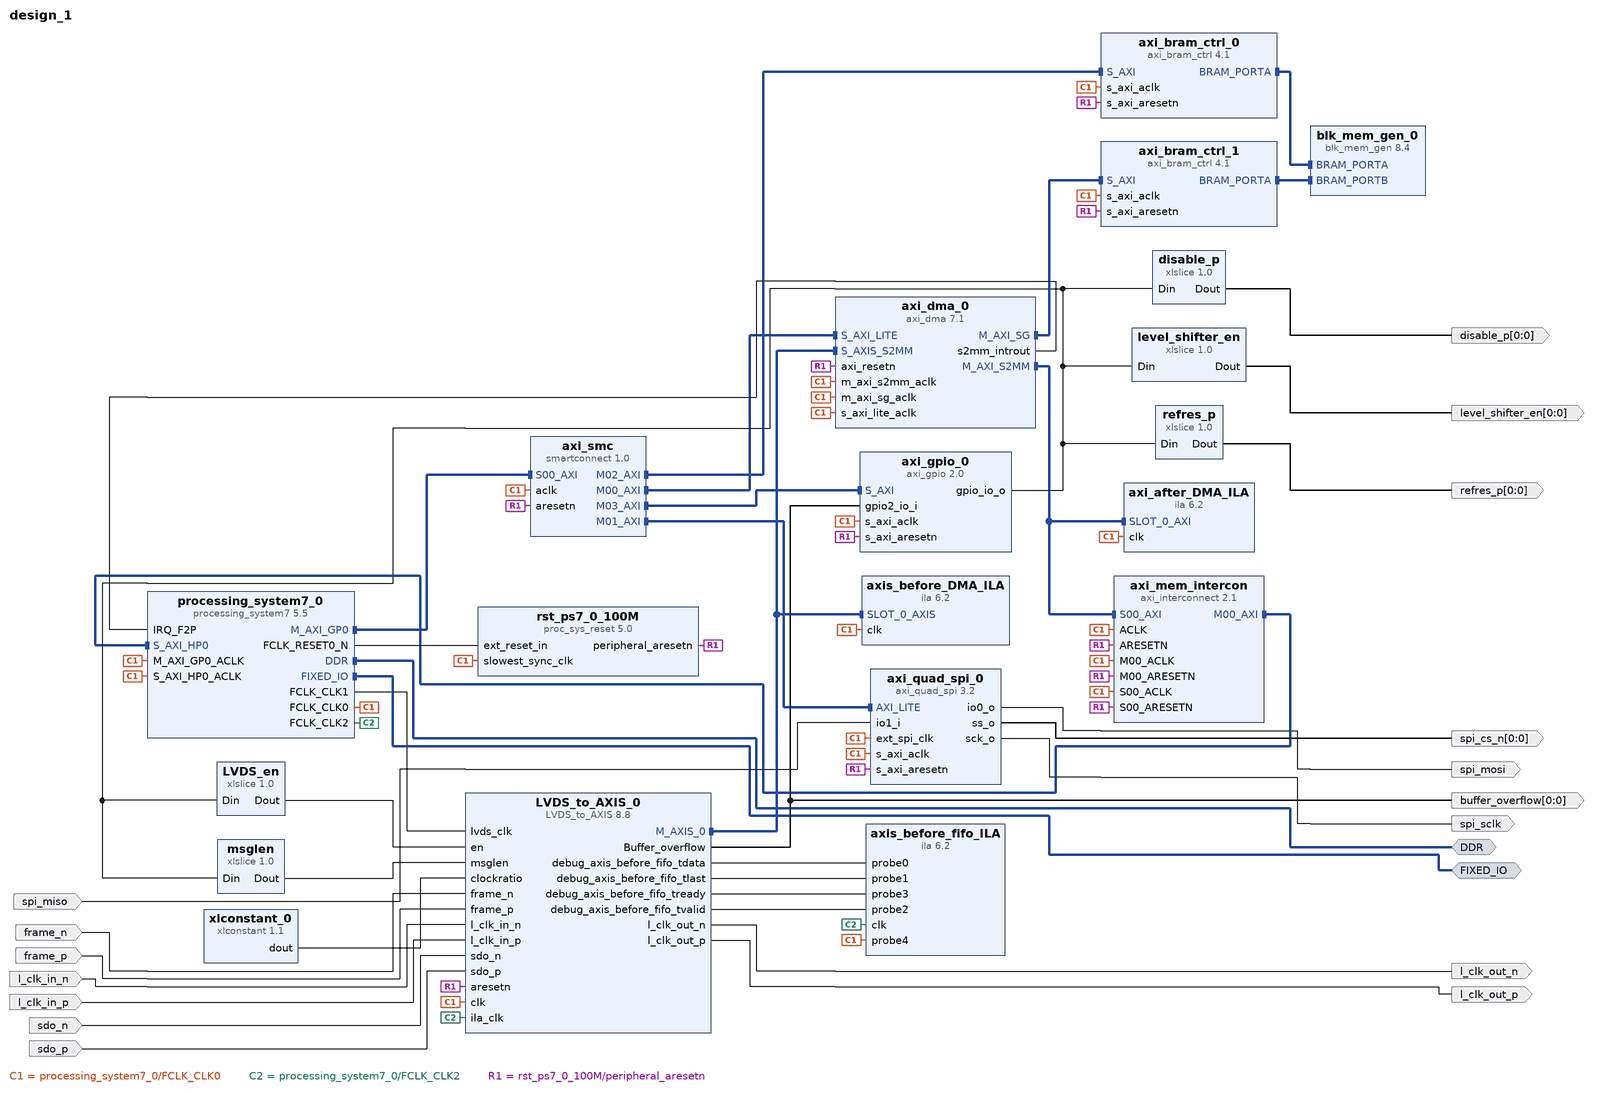
[diagram p0: block diagram of the top level]
# Vivado block design design_1, xc7z020clg484-1, Vivado 2024.2
create_bd_design design_1

create_bd_intf_port -mode Master -vlnv xilinx.com:interface:ddrx_rtl:1.0 DDR
create_bd_intf_port -mode Master -vlnv xilinx.com:display_processing_system7:fixedio_rtl:1.0 FIXED_IO
create_bd_port -dir O l_clk_out_n
create_bd_port -dir O l_clk_out_p
create_bd_port -dir I frame_p
create_bd_port -dir I frame_n
create_bd_port -dir I l_clk_in_n
create_bd_port -dir I l_clk_in_p
create_bd_port -dir I sdo_n
create_bd_port -dir I sdo_p
create_bd_port -dir O -from 0 -to 0 level_shifter_en
create_bd_port -dir O -from 0 -to 0 refres_p
create_bd_port -dir O -from 0 -to 0 disable_p
create_bd_port -dir O -from 0 -to 0 spi_cs_n
create_bd_port -dir O spi_sclk
create_bd_port -dir I spi_miso
create_bd_port -dir O spi_mosi
create_bd_port -dir O -from 0 -to 0 buffer_overflow

create_bd_cell -type ip -vlnv xilinx.com:user:LVDS_to_AXIS:8.8 LVDS_to_AXIS_0
create_bd_cell -type ip -vlnv xilinx.com:ip:axi_dma:7.1 axi_dma_0
set_property -dict [list \
  CONFIG.c_include_mm2s 0 \
  CONFIG.c_m_axi_s2mm_data_width 64 \
  CONFIG.c_s2mm_burst_size 256 \
  CONFIG.c_s_axis_s2mm_tdata_width 64 \
  CONFIG.c_sg_include_stscntrl_strm 0 \
] [get_bd_cells axi_dma_0]
create_bd_cell -type ip -vlnv xilinx.com:ip:xlconstant:1.1 xlconstant_0
set_property -dict {CONFIG.CONST_VAL 2 CONFIG.CONST_WIDTH 3} [get_bd_cells xlconstant_0]
create_bd_cell -type ip -vlnv xilinx.com:ip:axi_quad_spi:3.2 axi_quad_spi_0
set_property -dict {CONFIG.C_FIFO_DEPTH 256 CONFIG.C_USE_STARTUP 0} [get_bd_cells axi_quad_spi_0]
create_bd_cell -type ip -vlnv xilinx.com:ip:processing_system7:5.5 processing_system7_0
set_property -dict [list \
  CONFIG.PCW_APU_PERIPHERAL_FREQMHZ 667.0 \
  CONFIG.PCW_ENET0_ENET0_IO {MIO 16 .. 27} \
  CONFIG.PCW_ENET0_GRP_MDIO_ENABLE 1 \
  CONFIG.PCW_ENET0_GRP_MDIO_IO EMIO \
  CONFIG.PCW_ENET0_PERIPHERAL_CLKSRC External \
  CONFIG.PCW_ENET0_PERIPHERAL_ENABLE 1 \
  CONFIG.PCW_ENET0_RESET_ENABLE 0 \
  CONFIG.PCW_ENET_RESET_ENABLE 1 \
  CONFIG.PCW_ENET_RESET_SELECT {Share reset pin} \
  CONFIG.PCW_EN_CLK1_PORT 1 \
  CONFIG.PCW_EN_CLK2_PORT 1 \
  CONFIG.PCW_FCLK_CLK1_BUF TRUE \
  CONFIG.PCW_FCLK_CLK2_BUF TRUE \
  CONFIG.PCW_FPGA0_PERIPHERAL_FREQMHZ 50 \
  CONFIG.PCW_FPGA1_PERIPHERAL_FREQMHZ 100 \
  CONFIG.PCW_FPGA2_PERIPHERAL_FREQMHZ 200 \
  CONFIG.PCW_FPGA_FCLK1_ENABLE 1 \
  CONFIG.PCW_FPGA_FCLK2_ENABLE 1 \
  CONFIG.PCW_GPIO_MIO_GPIO_ENABLE 1 \
  CONFIG.PCW_GPIO_MIO_GPIO_IO MIO \
  CONFIG.PCW_I2C_RESET_ENABLE 1 \
  CONFIG.PCW_IRQ_F2P_INTR 1 \
  CONFIG.PCW_PRESET_BANK1_VOLTAGE {LVCMOS 1.8V} \
  CONFIG.PCW_QSPI_GRP_FBCLK_ENABLE 1 \
  CONFIG.PCW_QSPI_GRP_FBCLK_IO {MIO 8} \
  CONFIG.PCW_QSPI_GRP_SINGLE_SS_ENABLE 1 \
  CONFIG.PCW_QSPI_GRP_SINGLE_SS_IO {MIO 1 .. 6} \
  CONFIG.PCW_QSPI_PERIPHERAL_ENABLE 1 \
  CONFIG.PCW_QSPI_QSPI_IO {MIO 1 .. 6} \
  CONFIG.PCW_SD0_GRP_CD_ENABLE 1 \
  CONFIG.PCW_SD0_GRP_CD_IO {MIO 47} \
  CONFIG.PCW_SD0_GRP_WP_ENABLE 1 \
  CONFIG.PCW_SD0_GRP_WP_IO EMIO \
  CONFIG.PCW_SD0_PERIPHERAL_ENABLE 1 \
  CONFIG.PCW_SD0_SD0_IO {MIO 40 .. 45} \
  CONFIG.PCW_SDIO_PERIPHERAL_FREQMHZ 50 \
  CONFIG.PCW_SINGLE_QSPI_DATA_MODE x4 \
  CONFIG.PCW_TTC0_PERIPHERAL_ENABLE 1 \
  CONFIG.PCW_TTC0_TTC0_IO EMIO \
  CONFIG.PCW_UART1_PERIPHERAL_ENABLE 1 \
  CONFIG.PCW_UART1_UART1_IO {MIO 48 .. 49} \
  CONFIG.PCW_UART_PERIPHERAL_FREQMHZ 100 \
  CONFIG.PCW_UIPARAM_DDR_FREQ_MHZ 533.333 \
  CONFIG.PCW_UIPARAM_DDR_PARTNO {MT41K128M16 JT-125} \
  CONFIG.PCW_USB0_PERIPHERAL_ENABLE 1 \
  CONFIG.PCW_USB0_RESET_ENABLE 1 \
  CONFIG.PCW_USB0_RESET_IO {MIO 46} \
  CONFIG.PCW_USB0_USB0_IO {MIO 28 .. 39} \
  CONFIG.PCW_USB_RESET_ENABLE 1 \
  CONFIG.PCW_USB_RESET_SELECT {Share reset pin} \
  CONFIG.PCW_USE_FABRIC_INTERRUPT 1 \
  CONFIG.PCW_USE_S_AXI_HP0 1 \
] [get_bd_cells processing_system7_0]
# 219 more settings of processing_system7_0 are not shown: defaults, MIO pin electricals, DDR timing, and values the tool derives
create_bd_cell -type ip -vlnv xilinx.com:ip:smartconnect:1.0 axi_smc
set_property -dict {CONFIG.NUM_MI 4 CONFIG.NUM_SI 1} [get_bd_cells axi_smc]
create_bd_cell -type ip -vlnv xilinx.com:ip:proc_sys_reset:5.0 rst_ps7_0_100M
create_bd_cell -type ip -vlnv xilinx.com:ip:axi_interconnect:2.1 axi_mem_intercon
set_property -dict {CONFIG.NUM_MI 1} [get_bd_cells axi_mem_intercon]
create_bd_cell -type ip -vlnv xilinx.com:ip:axi_gpio:2.0 axi_gpio_0
set_property -dict [list \
  CONFIG.C_ALL_INPUTS 0 \
  CONFIG.C_ALL_INPUTS_2 1 \
  CONFIG.C_ALL_OUTPUTS 1 \
  CONFIG.C_GPIO2_WIDTH 1 \
  CONFIG.C_GPIO_WIDTH 11 \
  CONFIG.C_IS_DUAL 1 \
  CONFIG.GPIO_BOARD_INTERFACE Custom \
  CONFIG.USE_BOARD_FLOW true \
] [get_bd_cells axi_gpio_0]
create_bd_cell -type ip -vlnv xilinx.com:ip:axi_bram_ctrl:4.1 axi_bram_ctrl_0
set_property -dict {CONFIG.SINGLE_PORT_BRAM 1} [get_bd_cells axi_bram_ctrl_0]
create_bd_cell -type ip -vlnv xilinx.com:ip:axi_bram_ctrl:4.1 axi_bram_ctrl_1
set_property -dict {CONFIG.SINGLE_PORT_BRAM 1} [get_bd_cells axi_bram_ctrl_1]
create_bd_cell -type ip -vlnv xilinx.com:ip:blk_mem_gen:8.4 blk_mem_gen_0
set_property -dict {CONFIG.EN_SAFETY_CKT false CONFIG.Memory_Type True_Dual_Port_RAM} [get_bd_cells blk_mem_gen_0]
create_bd_cell -type ip -vlnv xilinx.com:ip:xlslice:1.0 LVDS_en
set_property -dict {CONFIG.DIN_WIDTH 11} [get_bd_cells LVDS_en]
create_bd_cell -type ip -vlnv xilinx.com:ip:xlslice:1.0 disable_p
set_property -dict {CONFIG.DIN_FROM 1 CONFIG.DIN_TO 1 CONFIG.DIN_WIDTH 11} [get_bd_cells disable_p]
create_bd_cell -type ip -vlnv xilinx.com:ip:xlslice:1.0 refres_p
set_property -dict {CONFIG.DIN_FROM 2 CONFIG.DIN_TO 2 CONFIG.DIN_WIDTH 11} [get_bd_cells refres_p]
create_bd_cell -type ip -vlnv xilinx.com:ip:xlslice:1.0 level_shifter_en
set_property -dict {CONFIG.DIN_FROM 3 CONFIG.DIN_TO 3 CONFIG.DIN_WIDTH 11} [get_bd_cells level_shifter_en]
create_bd_cell -type ip -vlnv xilinx.com:ip:xlslice:1.0 msglen
set_property -dict {CONFIG.DIN_FROM 9 CONFIG.DIN_TO 4 CONFIG.DIN_WIDTH 11} [get_bd_cells msglen]
create_bd_cell -type ip -vlnv xilinx.com:ip:ila:6.2 axis_before_fifo_ILA
set_property -dict [list \
  CONFIG.C_MONITOR_TYPE Native \
  CONFIG.C_NUM_OF_PROBES 5 \
  CONFIG.C_PROBE0_WIDTH 64 \
  CONFIG.C_PROBE3_WIDTH 1 \
  CONFIG.C_SLOT_0_AXIS_TDATA_WIDTH 64 \
  CONFIG.C_SLOT_0_AXIS_TDEST_WIDTH 0 \
  CONFIG.C_SLOT_0_AXIS_TID_WIDTH 0 \
  CONFIG.C_SLOT_0_AXIS_TUSER_WIDTH 0 \
  CONFIG.C_SLOT_0_AXI_PROTOCOL AXI4S \
] [get_bd_cells axis_before_fifo_ILA]
create_bd_cell -type ip -vlnv xilinx.com:ip:ila:6.2 axis_before_DMA_ILA
set_property -dict {CONFIG.C_DATA_DEPTH 16384 CONFIG.C_SLOT_0_AXI_PROTOCOL AXI4S} [get_bd_cells axis_before_DMA_ILA]
create_bd_cell -type ip -vlnv xilinx.com:ip:ila:6.2 axi_after_DMA_ILA

# ---- connections ----

connect_bd_intf_net [get_bd_intf_pins LVDS_to_AXIS_0/M_AXIS_0] [get_bd_intf_pins axi_dma_0/S_AXIS_S2MM]
connect_bd_intf_net [get_bd_intf_pins LVDS_to_AXIS_0/M_AXIS_0] [get_bd_intf_pins axis_before_DMA_ILA/SLOT_0_AXIS]
connect_bd_intf_net [get_bd_intf_pins axi_bram_ctrl_0/BRAM_PORTA] [get_bd_intf_pins blk_mem_gen_0/BRAM_PORTA]
connect_bd_intf_net [get_bd_intf_pins axi_bram_ctrl_1/BRAM_PORTA] [get_bd_intf_pins blk_mem_gen_0/BRAM_PORTB]
connect_bd_intf_net [get_bd_intf_pins axi_dma_0/M_AXI_S2MM] [get_bd_intf_pins axi_mem_intercon/S00_AXI]
connect_bd_intf_net [get_bd_intf_pins axi_dma_0/M_AXI_S2MM] [get_bd_intf_pins axi_after_DMA_ILA/SLOT_0_AXI]
connect_bd_intf_net [get_bd_intf_pins axi_bram_ctrl_1/S_AXI] [get_bd_intf_pins axi_dma_0/M_AXI_SG]
connect_bd_intf_net [get_bd_intf_pins axi_mem_intercon/M00_AXI] [get_bd_intf_pins processing_system7_0/S_AXI_HP0]
connect_bd_intf_net [get_bd_intf_pins axi_smc/M00_AXI] [get_bd_intf_pins axi_dma_0/S_AXI_LITE]
connect_bd_intf_net [get_bd_intf_pins axi_smc/M01_AXI] [get_bd_intf_pins axi_quad_spi_0/AXI_LITE]
connect_bd_intf_net [get_bd_intf_pins axi_smc/M02_AXI] [get_bd_intf_pins axi_bram_ctrl_0/S_AXI]
connect_bd_intf_net [get_bd_intf_pins axi_smc/M03_AXI] [get_bd_intf_pins axi_gpio_0/S_AXI]
connect_bd_intf_net [get_bd_intf_ports DDR] [get_bd_intf_pins processing_system7_0/DDR]
connect_bd_intf_net [get_bd_intf_ports FIXED_IO] [get_bd_intf_pins processing_system7_0/FIXED_IO]
connect_bd_intf_net [get_bd_intf_pins processing_system7_0/M_AXI_GP0] [get_bd_intf_pins axi_smc/S00_AXI]
connect_bd_net [get_bd_pins LVDS_en/Dout] [get_bd_pins LVDS_to_AXIS_0/en]
connect_bd_net [get_bd_pins LVDS_to_AXIS_0/Buffer_overflow] [get_bd_pins axi_gpio_0/gpio2_io_i] [get_bd_ports buffer_overflow]
connect_bd_net [get_bd_pins LVDS_to_AXIS_0/debug_axis_before_fifo_tdata] [get_bd_pins axis_before_fifo_ILA/probe0]
connect_bd_net [get_bd_pins LVDS_to_AXIS_0/debug_axis_before_fifo_tlast] [get_bd_pins axis_before_fifo_ILA/probe1]
connect_bd_net [get_bd_pins LVDS_to_AXIS_0/debug_axis_before_fifo_tready] [get_bd_pins axis_before_fifo_ILA/probe3]
connect_bd_net [get_bd_pins LVDS_to_AXIS_0/debug_axis_before_fifo_tvalid] [get_bd_pins axis_before_fifo_ILA/probe2]
connect_bd_net [get_bd_pins LVDS_to_AXIS_0/l_clk_out_n] [get_bd_ports l_clk_out_n]
connect_bd_net [get_bd_pins LVDS_to_AXIS_0/l_clk_out_p] [get_bd_ports l_clk_out_p]
connect_bd_net [get_bd_pins axi_gpio_0/gpio_io_o] \
  [get_bd_pins LVDS_en/Din] [get_bd_pins disable_p/Din] [get_bd_pins refres_p/Din] [get_bd_pins level_shifter_en/Din] \
  [get_bd_pins msglen/Din]
connect_bd_net [get_bd_pins axi_dma_0/s2mm_introut] [get_bd_pins processing_system7_0/IRQ_F2P]
connect_bd_net [get_bd_pins axi_quad_spi_0/io0_o] [get_bd_ports spi_mosi]
connect_bd_net [get_bd_pins axi_quad_spi_0/sck_o] [get_bd_ports spi_sclk]
connect_bd_net [get_bd_pins axi_quad_spi_0/ss_o] [get_bd_ports spi_cs_n]
connect_bd_net [get_bd_pins disable_p/Dout] [get_bd_ports disable_p]
connect_bd_net -net frame_n_0_1 [get_bd_ports frame_n] [get_bd_pins LVDS_to_AXIS_0/frame_n]
connect_bd_net -net frame_p_0_1 [get_bd_ports frame_p] [get_bd_pins LVDS_to_AXIS_0/frame_p]
connect_bd_net -net io1_i_0_1 [get_bd_ports spi_miso] [get_bd_pins axi_quad_spi_0/io1_i]
connect_bd_net -net l_clk_in_n_0_1 [get_bd_ports l_clk_in_n] [get_bd_pins LVDS_to_AXIS_0/l_clk_in_n]
connect_bd_net -net l_clk_in_p_0_1 [get_bd_ports l_clk_in_p] [get_bd_pins LVDS_to_AXIS_0/l_clk_in_p]
connect_bd_net [get_bd_pins level_shifter_en/Dout] [get_bd_ports level_shifter_en]
connect_bd_net [get_bd_pins msglen/Dout] [get_bd_pins LVDS_to_AXIS_0/msglen]
connect_bd_net [get_bd_pins processing_system7_0/FCLK_CLK0] \
  [get_bd_pins processing_system7_0/M_AXI_GP0_ACLK] [get_bd_pins axi_smc/aclk] [get_bd_pins axi_dma_0/s_axi_lite_aclk] \
  [get_bd_pins rst_ps7_0_100M/slowest_sync_clk] [get_bd_pins axi_quad_spi_0/s_axi_aclk] \
  [get_bd_pins axi_dma_0/m_axi_s2mm_aclk] [get_bd_pins axi_mem_intercon/S00_ACLK] \
  [get_bd_pins processing_system7_0/S_AXI_HP0_ACLK] [get_bd_pins axi_mem_intercon/M00_ACLK] \
  [get_bd_pins axi_mem_intercon/ACLK] [get_bd_pins axi_bram_ctrl_0/s_axi_aclk] [get_bd_pins axi_bram_ctrl_1/s_axi_aclk] \
  [get_bd_pins axi_dma_0/m_axi_sg_aclk] [get_bd_pins axi_gpio_0/s_axi_aclk] [get_bd_pins axi_quad_spi_0/ext_spi_clk] \
  [get_bd_pins axis_before_DMA_ILA/clk] [get_bd_pins axi_after_DMA_ILA/clk] [get_bd_pins LVDS_to_AXIS_0/clk] \
  [get_bd_pins axis_before_fifo_ILA/probe4]
connect_bd_net [get_bd_pins processing_system7_0/FCLK_CLK1] [get_bd_pins LVDS_to_AXIS_0/lvds_clk]
connect_bd_net [get_bd_pins processing_system7_0/FCLK_CLK2] [get_bd_pins axis_before_fifo_ILA/clk] [get_bd_pins LVDS_to_AXIS_0/ila_clk]
connect_bd_net [get_bd_pins processing_system7_0/FCLK_RESET0_N] [get_bd_pins rst_ps7_0_100M/ext_reset_in]
connect_bd_net [get_bd_pins refres_p/Dout] [get_bd_ports refres_p]
connect_bd_net [get_bd_pins rst_ps7_0_100M/peripheral_aresetn] \
  [get_bd_pins axi_dma_0/axi_resetn] [get_bd_pins axi_smc/aresetn] [get_bd_pins axi_quad_spi_0/s_axi_aresetn] \
  [get_bd_pins axi_mem_intercon/S00_ARESETN] [get_bd_pins axi_mem_intercon/M00_ARESETN] \
  [get_bd_pins axi_mem_intercon/ARESETN] [get_bd_pins axi_bram_ctrl_0/s_axi_aresetn] \
  [get_bd_pins axi_bram_ctrl_1/s_axi_aresetn] [get_bd_pins axi_gpio_0/s_axi_aresetn] [get_bd_pins LVDS_to_AXIS_0/aresetn]
connect_bd_net -net sdo_n_0_1 [get_bd_ports sdo_n] [get_bd_pins LVDS_to_AXIS_0/sdo_n]
connect_bd_net -net sdo_p_0_1 [get_bd_ports sdo_p] [get_bd_pins LVDS_to_AXIS_0/sdo_p]
connect_bd_net [get_bd_pins xlconstant_0/dout] [get_bd_pins LVDS_to_AXIS_0/clockratio]
set_property HDL_ATTRIBUTE.BMM_INFO_PROCESSOR {arm > design_1 axi_bram_ctrl_0} [get_bd_cells processing_system7_0]
set_property HDL_ATTRIBUTE.KEEP_HIERARCHY yes [get_bd_cells processing_system7_0]
set_property HDL_ATTRIBUTE.BMM_INFO_ADDRESS_SPACE {byte  0x40000000 32 > design_1 blk_mem_gen_0} [get_bd_cells axi_bram_ctrl_0]
set_property HDL_ATTRIBUTE.KEEP_HIERARCHY yes [get_bd_cells axi_bram_ctrl_0]

# ---- address map ----
assign_bd_address -offset 0x00000000 -range 512M -target_address_space [get_bd_addr_spaces axi_dma_0/Data_S2MM] [get_bd_addr_segs processing_system7_0/S_AXI_HP0/HP0_DDR_LOWOCM]
assign_bd_address -offset 0x40000000 -range 8K -target_address_space [get_bd_addr_spaces axi_dma_0/Data_SG] [get_bd_addr_segs axi_bram_ctrl_1/S_AXI/Mem0]
assign_bd_address -offset 0x40000000 -range 8K -target_address_space [get_bd_addr_spaces processing_system7_0/Data] [get_bd_addr_segs axi_bram_ctrl_0/S_AXI/Mem0]
assign_bd_address -offset 0x40400000 -range 64K -target_address_space [get_bd_addr_spaces processing_system7_0/Data] [get_bd_addr_segs axi_dma_0/S_AXI_LITE/Reg]
assign_bd_address -offset 0x41200000 -range 64K -target_address_space [get_bd_addr_spaces processing_system7_0/Data] [get_bd_addr_segs axi_gpio_0/S_AXI/Reg]
assign_bd_address -offset 0x41E00000 -range 64K -target_address_space [get_bd_addr_spaces processing_system7_0/Data] [get_bd_addr_segs axi_quad_spi_0/AXI_LITE/Reg]

validate_bd_design
save_bd_design
